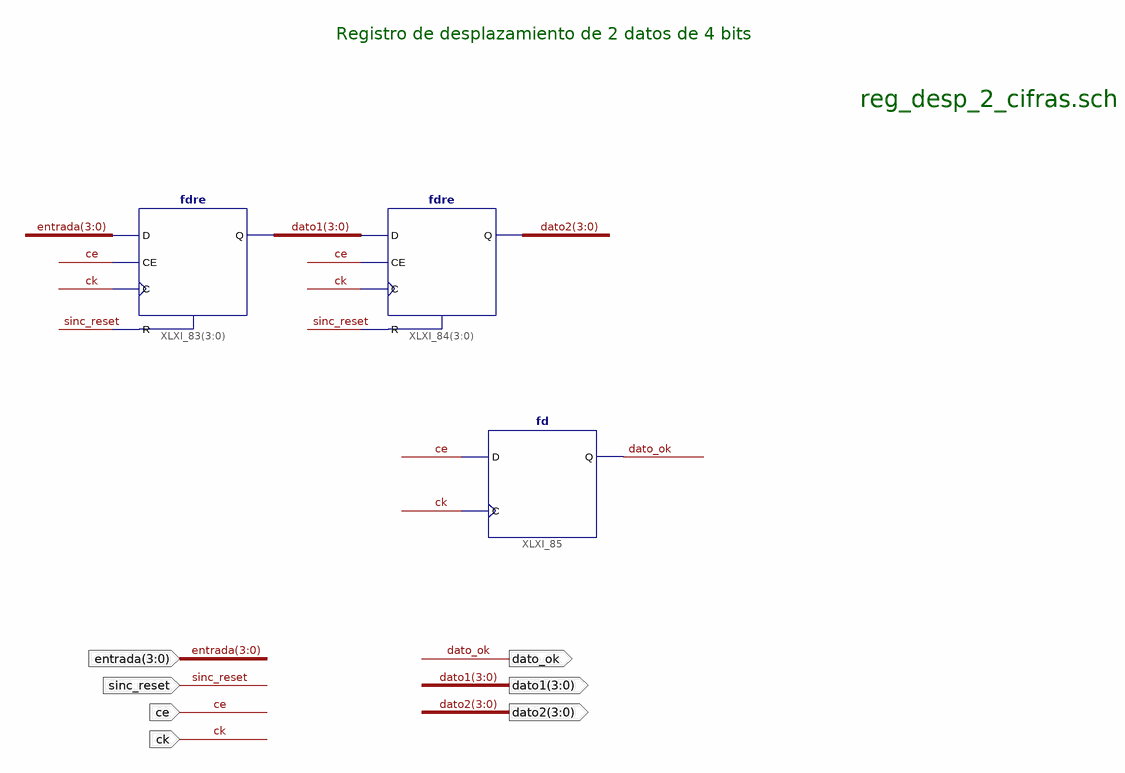
[diagram p0: schematic sheet 1]
// Xilinx ISE schematic reg_desp_2_cifras.sch (spartan6) as structural Verilog: 3 symbols, 7 ports
module reg_desp_2_cifras (
  input  [3:0] entrada,
  input  ck,
  input  ce,
  input  sinc_reset,
  output [3:0] dato1,
  output [3:0] dato2,
  output dato_ok
);

  fdre XLXI_83[3:0] (.C(ck), .CE(ce), .D(entrada), .R(sinc_reset), .Q(dato1));
  fdre XLXI_84[3:0] (.C(ck), .CE(ce), .D(dato1), .R(sinc_reset), .Q(dato2));
  fd XLXI_85 (.C(ck), .D(ce), .Q(dato_ok));

  // Notes on the sheet:
  //   Registro de desplazamiento de 2 datos de 4 bits
  //   reg_desp_2_cifras.sch
endmodule
